# Altium schematic sheet full.SchDoc
size A; SheetNumber: 1; SheetTotal: 1
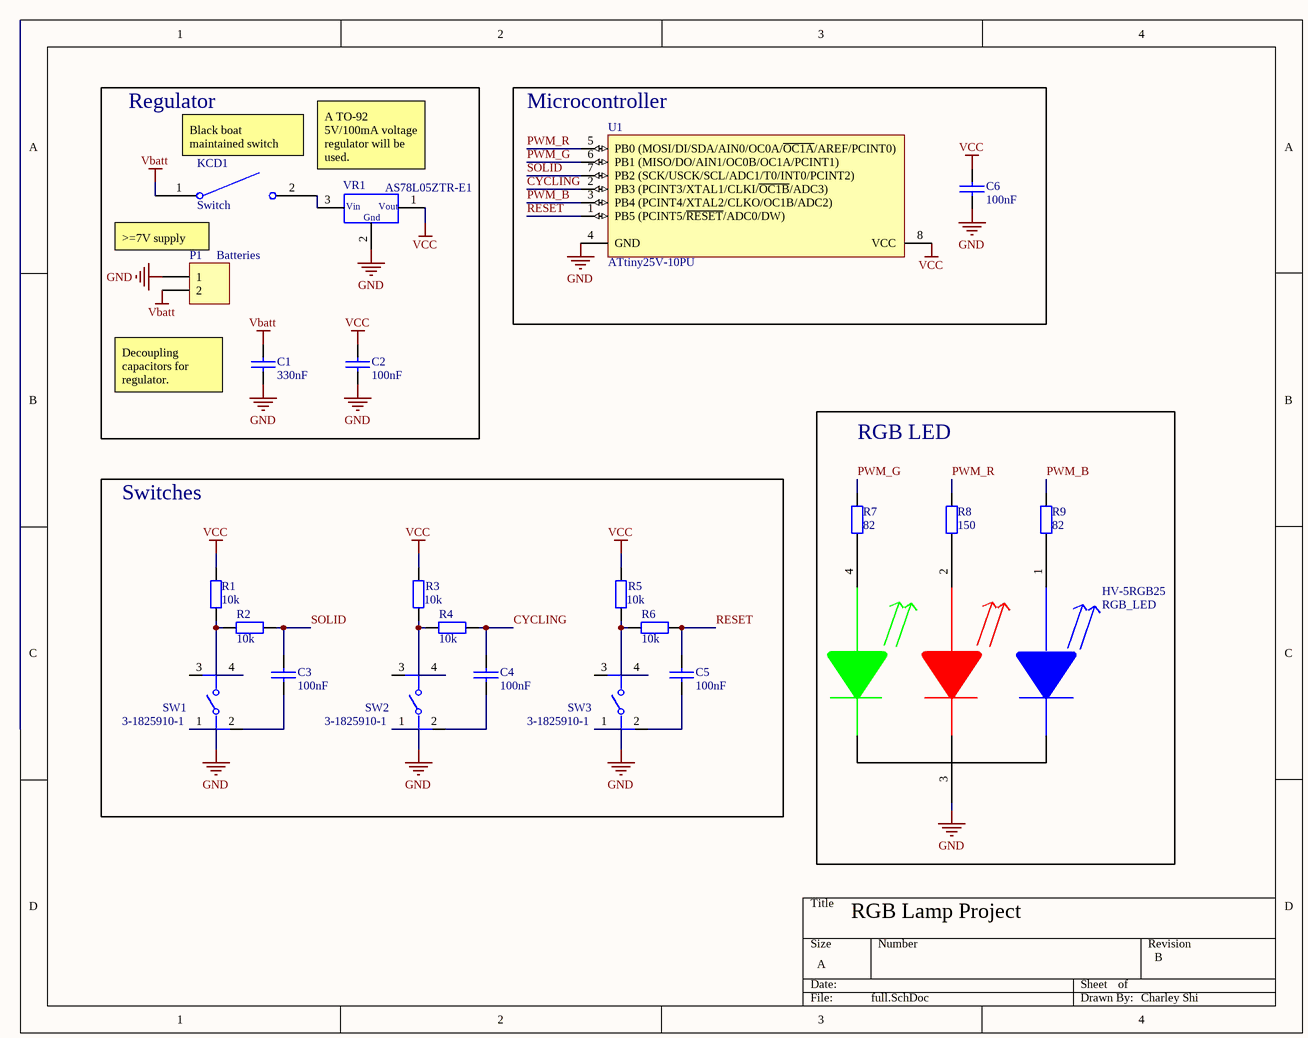
[diagram p0: full.SchDoc]

## Parts
C1  330nF  [ece-RAD0.2]
C2  100nF  [ece-RAD0.2]
C3  100nF  [ece-RAD0.2]
C4  100nF  [ece-RAD0.2]
C5  100nF  [ece-RAD0.2]
C6  100nF  [ece-RAD0.2]
HV-5RGB25  RGB_LED  [HV-5RGB25]
KCD1  Switch
P1  Batteries  [ece-HDR1X2]
R1  10k  [ece-AXIAL0.4]
R2  10k  [ece-AXIAL0.4]
R3  10k  [ece-AXIAL0.4]
R4  10k  [ece-AXIAL0.4]
R5  10k  [ece-AXIAL0.4]
R6  10k  [ece-AXIAL0.4]
R7  82  [ece-AXIAL0.4]
R8  150  [ece-AXIAL0.4]
R9  82  [ece-AXIAL0.4]
SW1  3-1825910-1  [FP-3-1825910-1-MFG]
SW2  3-1825910-1  [FP-3-1825910-1-MFG]
SW3  3-1825910-1  [FP-3-1825910-1-MFG]
U1  ATtiny25V-10PU  [8P3]
VR1  AS78L05ZTR-E1  [ece-TO-92]

## Blocks framed on the sheet
Regulator: C1 C2 KCD1 P1 VR1
Microcontroller: C6 U1
RGB LED: HV-5RGB25 R7-R9
Switches: C3-C5 R1-R6 SW1-SW3

## Nets
GND: C1.2 C2.2 C6.2 HV-5RGB25.3((COM)) P1.1 SW1.1 SW2.1 SW3.1 U1.4(GND) VR1.2(Gnd)
Vbatt: C1.1 KCD1.1 P1.2
VCC: C2.1 C6.1 R1.2 R3.2 R5.2 U1.8(VCC) VR1.1(Vout)
CYCLING: C4.1 R4.2 U1.2(PB3_(PCINT3/XTAL1/CLKI/~{OC1B}/ADC3))
PWM_B: R9.2 U1.3(PB4_(PCINT4/XTAL2/CLKO/OC1B/ADC2))
PWM_G: R7.2 U1.6(PB1_(MISO/DO/AIN1/OC0B/OC1A/PCINT1))
PWM_R: R8.2 U1.5(PB0_(MOSI/DI/SDA/AIN0/OC0A/~{OC1A}/AREF/PCINT0))
RESET: C5.1 R6.2 U1.1(PB5_(PCINT5/~{RESET}/ADC0/DW))
SOLID: C3.1 R2.2 U1.7(PB2_(SCK/USCK/SCL/ADC1/T0/INT0/PCINT2))
NetC3_2: C3.2 SW1.2
NetC4_2: C4.2 SW2.2
NetC5_2: C5.2 SW3.2
NetHV-5RGB25_1: HV-5RGB25.1(B) R9.1
NetHV-5RGB25_2: HV-5RGB25.2(R) R8.1
NetHV-5RGB25_4: HV-5RGB25.4(G) R7.1
NetKCD1_2: KCD1.2 VR1.3(Vin)
NetR1_1: R1.1 R2.1 SW1.4
NetR3_1: R3.1 R4.1 SW2.4
NetR5_1: R5.1 R6.1 SW3.4

Not connected (* = marked no-connect by the designer): SW1 3; SW2 3; SW3 3

## Notes on the sheet
- (near KCD1) Black boat maintained switch
- A TO-92 5V/100mA voltage regulator will be used.
- >=7V supply
- Decoupling capacitors for regulator.
- RGB Lamp Project
- B
- Charley Shi

## Library data of the parts
C1-C6 = CAP: Capacitor Non Polarised Through Hole; Value: *
P1 = Header 2: Header, 2-Pin; LatestRevisionDate: 17-Jul-2002; LatestRevisionNote: Re-released for DXP Platform.; Publisher: Altium Limited
R1-R9 = Res2: Resistor; Published: 8-Jun-2000; LatestRevisionDate: 17-Jul-2002; LatestRevisionNote: Re-released for DXP Platform.; PackageReference: AXIAL-0.4; Publisher: Altium Limited; Value: *
SW1-SW3 = CMP-03407-000001-1: SWITCH TACTILE SPST-NO 0.05A 24V; Manufacturer: TE Connectivity; Operating Force: 160gf; Contact Current Rating: 50mA; Contact Resistance: 100mΩ; Electromechanical Life: 100000Cycles; Device Class L1: Electromechanical; ComponentLink2URL: https://www.te.com/commerce/DocumentDelivery/DDEController?Action=srchrtrv&DocNm=1825910&DocType=Customer+Drawing&DocLang=English; Category: Switch; Device Class L2: Switches; Temperature: -35°C to +85°C; RoHS: TRUE; Mount: Through Hole; Manufacturer Part Number: 3-1825910-1; Automotive: No; Lead Free: Yes; Device Class L3: Tactile Switches; ComponentLink2Description: Datasheet; Temperature Range High: +85°C; Height: 17.3mm; Package: 0; Temperature Range Low: -35°C; Throw Configuration: SPST-NO; Digikey Description: SWITCH TACTILE SPST-NO 0.05A 24V; Octopart: https://octopart.com/3-1825910-1-te+connectivity-46506874
U1 = CMP-0093-00022-2: 8-bit AVR Microcontroller, 10MHz, 1.8-5.5V, 2KB Flash, 128 Bytes EEPROM, 128 Bytes SRAM, 8-pin PDIP, Industrial Grade (-40°C to 85°C), Pb-Free; PackageDescription: 8-Lead, 0.300" Wide Body, Plastic Dual In-Line Package (PDIP); ComponentLink1URL: http://www.atmel.com/; Code_JEDEC: MS-001-BA; ComponentLink3URL: http://www.atmel.com/dyn/resources/prod_documents/2586S.pdf; ComponentLink3Description: ATtiny25/45/85 Summary; RevisionNote: DatasheetVersion updated. URLs added.; PackageVersion: revB, Jan-2002; ComponentLink2URL: http://www.atmel.com/dyn/resources/prod_documents/doc2586.pdf; DatasheetVersion: revN, Apr-2011; PackageReference: 8P3; ComponentLink2Description: ATtiny25/45/85 Datasheet; ComponentLink1Description: Manufacturer URL
VR1 = VoltRegSmall: Voltage Regulator; Value: *